# Altium schematic sheet PAGE114.SchDoc
size 246 x 182 mm
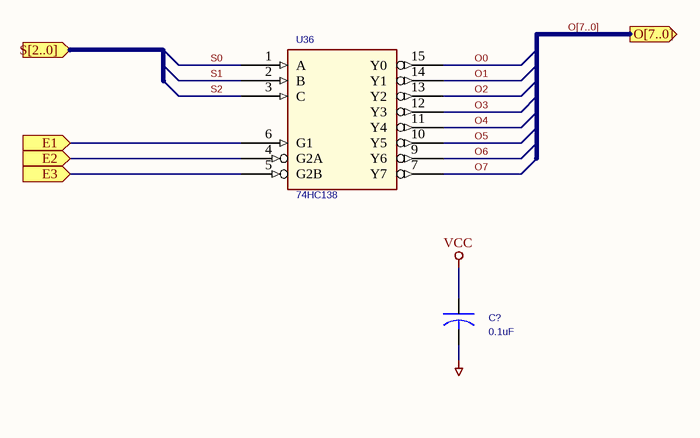
[diagram p0: PAGE114.SchDoc]

## Parts
C?  0.1uF  [AXIALCAP0.3]
U36  74HC138  [DIP16]

## Ports
E1 (in), E2 (in), E3 (in), O[7..0] (out), S[2..0] (in)

## Nets
AGND: C?.2
GND: U36.8(GND)
VCC: C?.1 U36.16(VCC)
E1: U36.6(G1) ; port E1
E2: U36.4(G2A) ; port E2
E3: U36.5(G2B) ; port E3
O0: U36.15(Y0)
O1: U36.14(Y1)
O2: U36.13(Y2)
O3: U36.12(Y3)
O4: U36.11(Y4)
O5: U36.10(Y5)
O6: U36.9(Y6)
O7: U36.7(Y7)
S0: U36.1(A)
S1: U36.2(B)
S2: U36.3(C)

## Buses and harness runs
bus O[7..0] = port O[7..0]

## Library data of the parts
C? = CAP_Dup1: PART NO: 80-C410C104M5U